# EAGLE design PFC_drivers_v1 (EAGLE 7.6.0)
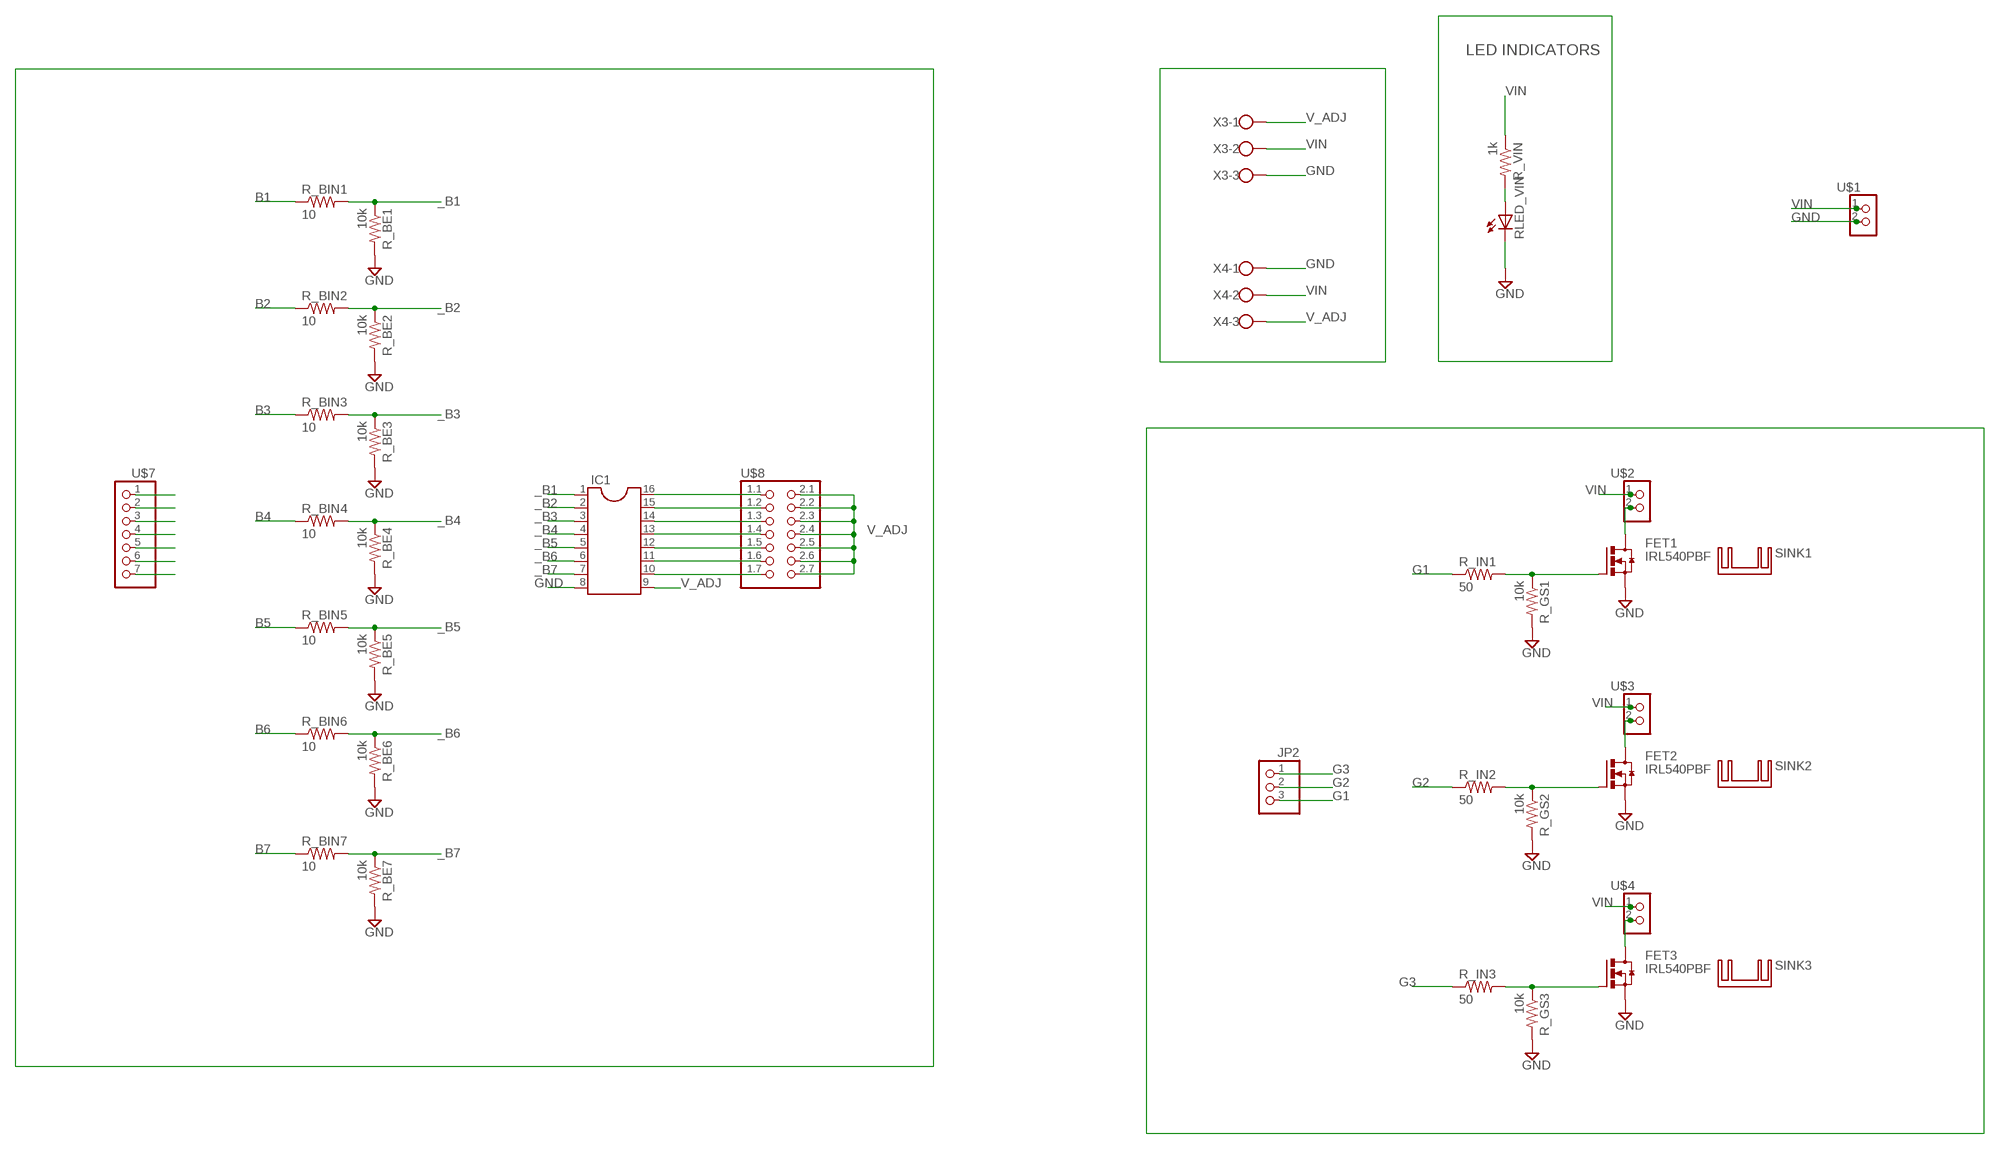
[diagram p0: schematic, sheet 1]

## Parts
FET1  IRL540PBF  [TO220AV]
FET2  IRL540PBF  [TO220AV]
FET3  IRL540PBF  [TO220AV]
IC1  DIL16S  [SOCKET-16]
JP2  PINHD-1X3  [1X03]
R_BE1  10k  R-US_R0603  [R0603]
R_BE2  10k  R-US_R0603  [R0603]
R_BE3  10k  R-US_R0603  [R0603]
R_BE4  10k  R-US_R0603  [R0603]
R_BE5  10k  R-US_R0603  [R0603]
R_BE6  10k  R-US_R0603  [R0603]
R_BE7  10k  R-US_R0603  [R0603]
R_BIN1  10  R-US_R0603  [R0603]
R_BIN2  10  R-US_R0603  [R0603]
R_BIN3  10  R-US_R0603  [R0603]
R_BIN4  10  R-US_R0603  [R0603]
R_BIN5  10  R-US_R0603  [R0603]
R_BIN6  10  R-US_R0603  [R0603]
R_BIN7  10  R-US_R0603  [R0603]
R_GS1  10k  R-US_R0603  [R0603]
R_GS2  10k  R-US_R0603  [R0603]
R_GS3  10k  R-US_R0603  [R0603]
R_IN1  50  R-US_R0603  [R0603]
R_IN2  50  R-US_R0603  [R0603]
R_IN3  50  R-US_R0603  [R0603]
R_VIN  1k  R-US_R0603  [R0603]
RLED_VIN  LEDCHIP-LED0603  [CHIP-LED0603]
SINK1  FW1S  [FW1S]
SINK2  FW1S  [FW1S]
SINK3  FW1S  [FW1S]
U$1  PINHD-2X1  [2X01]
U$2  PINHD-2X1  [2X01]
U$3  PINHD-2X1  [2X01]
U$4  PINHD-2X1  [2X01]
U$7  PINHD-1X7  [1X07]
U$8  PINHD-2X7  [2X07-BIG]
X3  W237-103  [W237-103]
X4  W237-103  [W237-103]

## Nets
_B1: IC1.1 R_BE1.1 R_BIN1.2
_B2: IC1.2 R_BE2.1 R_BIN2.2
_B3: IC1.3 R_BE3.1 R_BIN3.2
_B4: IC1.4 R_BE4.1 R_BIN4.2
_B5: IC1.5 R_BE5.1 R_BIN5.2
_B6: IC1.6 R_BE6.1 R_BIN6.2
_B7: IC1.7 R_BE7.1 R_BIN7.2
_G1: FET1.B(G) R_GS1.1 R_IN1.2
_G2: FET2.B(G) R_GS2.1 R_IN2.2
_G3: FET3.B(G) R_GS3.1 R_IN3.2
B1: R_BIN1.1 U$7.1
B2: R_BIN2.1 U$7.2
B3: R_BIN3.1 U$7.3
B4: R_BIN4.1 U$7.4
B5: R_BIN5.1 U$7.5
B6: R_BIN6.1 U$7.6
B7: R_BIN7.1 U$7.7
G1: JP2.3 R_IN1.1
G2: JP2.2 R_IN2.1
G3: JP2.1 R_IN3.1
GND: FET1.E(S) FET2.E(S) FET3.E(S) IC1.8 R_BE1.2 R_BE2.2 R_BE3.2 R_BE4.2 R_BE5.2 R_BE6.2 R_BE7.2 R_GS1.2 R_GS2.2 R_GS3.2 RLED_VIN.C U$1.2 X3.3 X4.1
N$1: R_VIN.2 RLED_VIN.A
N$4: IC1.10 U$8.1.7
N$5: IC1.11 U$8.1.6
N$7: IC1.12 U$8.1.5
N$8: IC1.13 U$8.1.4
N$9: IC1.14 U$8.1.3
N$10: IC1.15 U$8.1.2
N$11: IC1.16 U$8.1.1
N$15: FET1.C(D) U$2.2
N$16: FET2.C(D) U$3.2
N$17: FET3.C(D) U$4.2
V_ADJ: IC1.9 U$8.2.1 U$8.2.2 U$8.2.3 U$8.2.4 U$8.2.5 U$8.2.6 U$8.2.7 X3.1 X4.3
VIN: R_VIN.1 U$1.1 U$2.1 U$3.1 U$4.1 X3.2 X4.2

## Notes on the sheet
- LED INDICATORS

## Library data of the parts
FET1-FET3 = transistor-power:IRL540PBF
IC1 = ic-package:DIL16: Dual In Line / Socket
JP2 = adafruit:PINHD-1X3: PIN HEADER
R_BE1-R_BE7 R_BIN1-R_BIN7 R_GS1-R_GS3 R_IN1-R_IN3 R_VIN = resistor:R-US_: RESISTOR, American symbol
RLED_VIN = led:LED: LED OSRAM: - CHIPLED LG R971, LG N971, LY N971, LG Q971, LY Q971, LO R971, LY R971 LH N974, LH R974 LS Q976, LO Q976, LY Q976 LO Q996 - Hyper CHIPLED LW Q18S LB Q993, LB Q99A, LB R99A - SideLED LS A670, LO A670, LY A670, LG A670, LP A670 LB A673, LV A673, LT A673, LW A673 LH A674 LY A675 LS A676, LA A676, LO A676, LY A676, LW A676 LS A679, LY A679, LG A679 - Hyper Micro SIDELED® LS Y876, LA Y876, LO Y876, LY Y876 LT Y87S - SmartLED LW L88C, LW L88S LB L89C, LB L89S, LG L890 LS L89K, LO L89K, LY L89K LS L896, LA L896, LO L896, LY L896 - TOPLED LS T670, LO T670, LY T670, LG T670, LP T670 LSG T670, LSP T670, LSY T670, LOP T670, LYG T670 LG T671, LOG T671, LSG T671 LB T673, LV T673, LT T673, LW T673 LH T674 LS T676, LA T676, LO T676, LY T676, LB T676, LH T676, LSB T676, LW T676 LB T67C, LV T67C, LT T67C, LS T67K, LO T67K, LY T67K, LW E67C LS E67B, LA E67B, LO E67B, LY E67B, LB E67C, LV E67C, LT E67C LW T67C LS T679, LY T679, LG T679 LS T770, LO T770, LY T770, LG T770, LP T770 LB T773, LV T773, LT T773, LW T773 LH T774 LS E675, LA E675, LY E675, LS T675 LS T776, LA T776, LO T776, LY T776, LB T776 LHGB T686 LT T68C, LB T68C - Hyper Mini TOPLED® LB M676 - Mini TOPLED Santana® LG M470 LS M47K, LO M47K, LY M47K Source: http://www.osram.convergy.de LUXEON: - LUMILED® LXK2-PW12-R00, LXK2-PW12-S00, LXK2-PW14-U00, LXK2-PW14-V00 LXK2-PM12-R00, LXK2-PM12-S00, LXK2-PM14-U00 LXK2-PE12-Q00, LXK2-PE12-R00, LXK2-PE12-S00, LXK2-PE14-T00, LXK2-PE14-U00 LXK2-PB12-K00, LXK2-PB12-L00, LXK2-PB12-M00, LXK2-PB14-N00, LXK2-PB14-P00, LXK2-PB14-Q00 LXK2-PR12-L00, LXK2-PR12-M00, LXK2-PR14-Q00, LXK2-PR14-R00 LXK2-PD12-Q00, LXK2-PD12-R00, LXK2-PD12-S00 LXK2-PH12-R00, LXK2-PH12-S00 LXK2-PL12-P00, LXK2-PL12-Q00, LXK2-PL12-R00 Source: www.luxeon.com KINGBRIGHT: KA-3528ASYC Source: www.kingbright.com
SINK1-SINK3 = heatsink:FW1S
U$1-U$4 = pinhead:PINHD-2X1
U$7 = adafruit:PINHD-1X7
U$8 = adafruit:PINHD-2X7
X3 X4 = con-wago-500:W237-103: WAGO SCREW CLAMP; MPN: 237-103; OC_FARNELL: unknown; OC_NEWARK: 18M7116

## Board
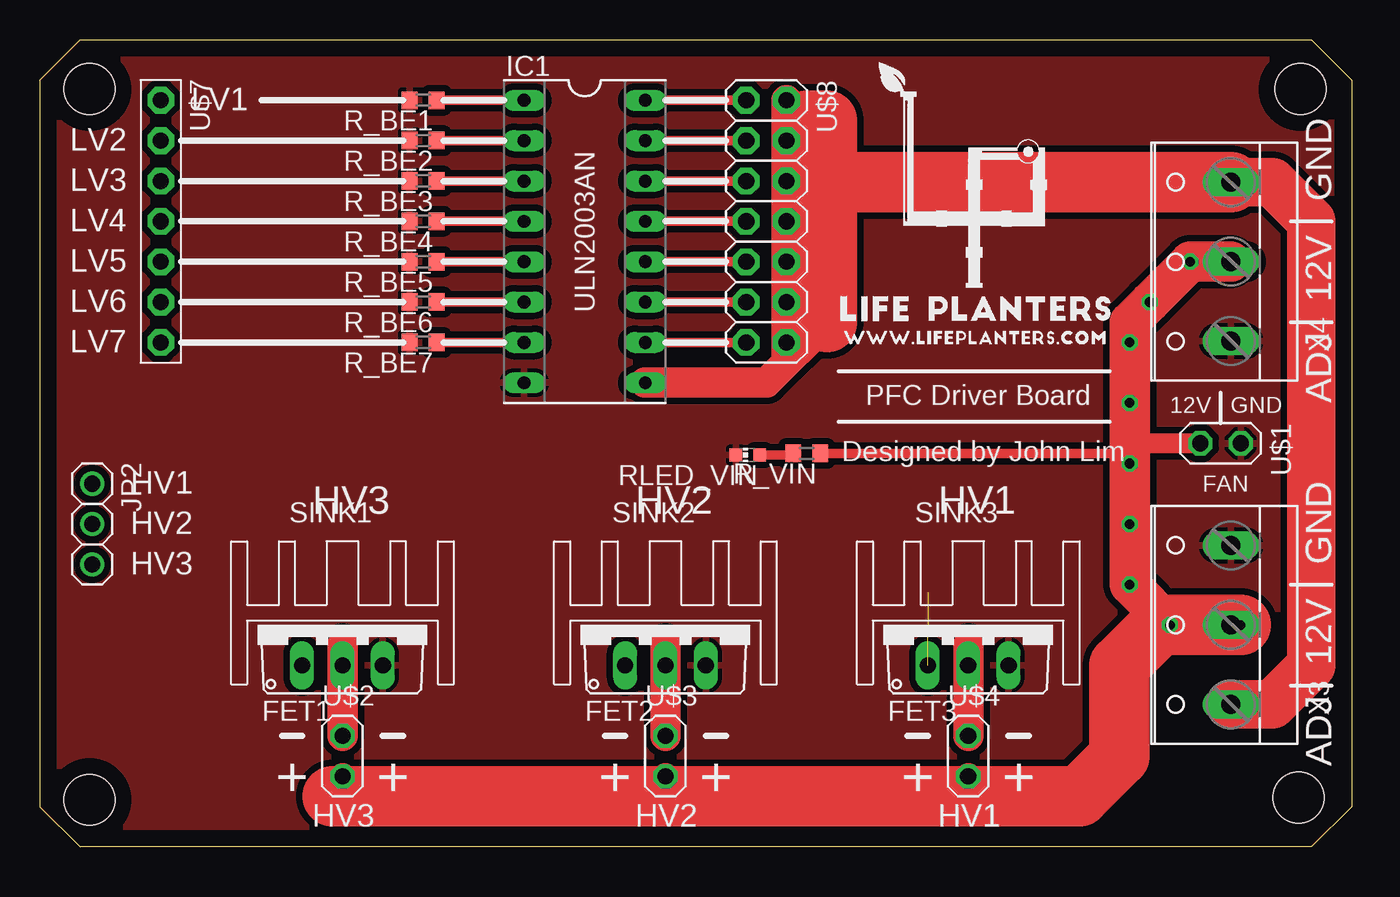
[diagram p1: board, top side]
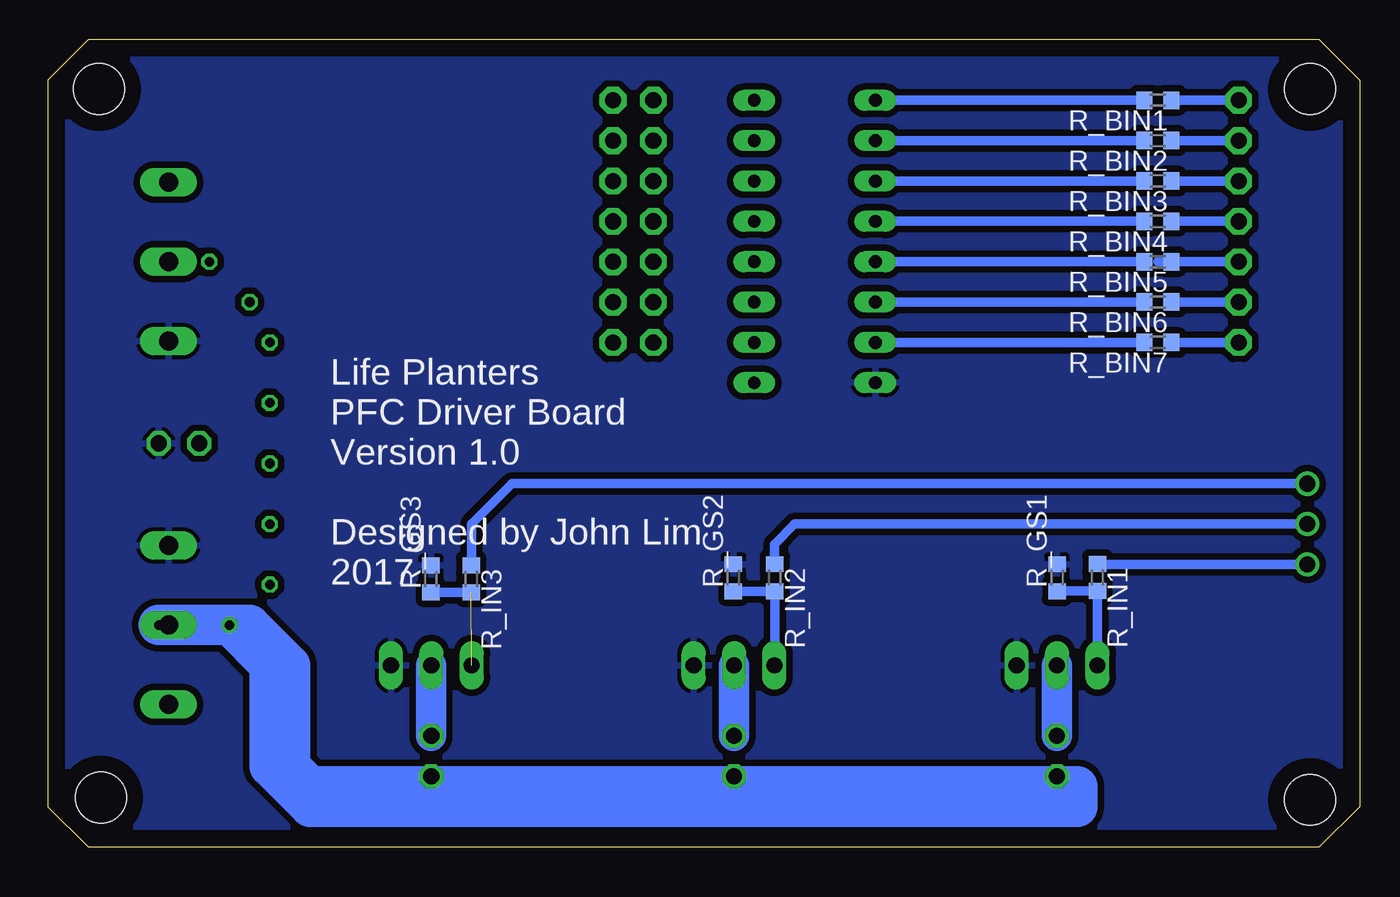
[diagram p2: board, bottom side, seen from below]

Size 82.55 x 50.8 mm. Coordinates in mm from the lower left corner, seen from the top.
Outline: 0,48.26 0,2.54 2.54,0 80.01,0 82.55,2.54 82.55,48.26 80.01,50.8 2.54,50.8 0,48.26
Copper layers (1*16): Top 0.035mm / dielectric 1.5mm / Bottom 0.035mm
Design rules "default": minimum track width 10mil, minimum drill 24mil, track to track 8mil, track to pad 8mil, pad to pad 8mil, via to via 8mil, smd to smd 8mil, copper to edge 40mil, drill to drill 8mil, minimum pad ring 10mil, minimum via ring 8mil, stop-mask expansion 4mil, vias tented up to drill 0mil, thermal gap 10mil
Holes 3.2 mm at 3.12,2.96 3.12,47.69 79.2,3.1 79.33,47.69

### Footprints (pad centres in the part's own frame; a part is rotated, then mirrored left to right if it is on the bottom)
TO220AV = drill 1.016 long: B -2.54,-2.54; C 0,-2.54; E 2.54,-2.54
SOCKET-16 = drill 0.813 long: 1 -8.89,-3.81; 2 -6.35,-3.81; 3 -3.81,-3.81; 4 -1.27,-3.81; 5 1.27,-3.81; 6 3.81,-3.81; 7 6.35,-3.81; 8 8.89,-3.81; 9 8.89,3.81; 10 6.35,3.81; 11 3.81,3.81; 12 1.27,3.81; 13 -1.27,3.81; 14 -3.81,3.81; 15 -6.35,3.81; 16 -8.89,3.81
1X03 = drill 1.016: 1 -2.54,0; 2 0,0; 3 2.54,0
R0603 = smd 1 x 1.1: 1 -0.85,0; 2 0.85,0
CHIP-LED0603 = smd 0.8 x 0.8: A 0,-0.75; C 0,0.75
2X01 = drill 1.016 octagon: 1 -1.27,-1.27; 2 -1.27,1.27
1X07 = drill 1.016 pad 1.676 octagon: 1 -7.62,0; 2 -5.08,0; 3 -2.54,0; 4 0,0; 5 2.54,0; 6 5.08,0; 7 7.62,0
2X07-BIG = drill 1.016 pad 1.676 octagon: 1.1 -7.62,-1.27; 1.2 -5.08,-1.27; 1.3 -2.54,-1.27; 1.4 0,-1.27; 1.5 2.54,-1.27; 1.6 5.08,-1.27; 1.7 7.62,-1.27; 2.1 -7.62,1.27; 2.2 -5.08,1.27; 2.3 -2.54,1.27; 2.4 0,1.27; 2.5 2.54,1.27; 2.6 5.08,1.27; 2.7 7.62,1.27
W237-103 = drill 1.194 long: 1 -5,-1.29; 2 0,-1.29; 3 5,-1.29

### Placement (x,y rotation side)
FET1  19.05,13.97 0 top
FET2  39.37,13.97 0 top
FET3  58.42,13.97 0 top
IC1  34.29,38.1 270 top
JP2  3.3,20.32 270 top
R_BE1  24.13,46.99 180 top
R_BE2  24.13,44.45 180 top
R_BE3  24.13,41.91 180 top
R_BE4  24.13,39.37 180 top
R_BE5  24.13,36.83 180 top
R_BE6  24.13,34.29 180 top
R_BE7  24.13,31.75 180 top
R_BIN1  12.7,46.99 180 bottom
R_BIN2  12.7,44.45 180 bottom
R_BIN3  12.7,41.91 180 bottom
R_BIN4  12.7,39.37 180 bottom
R_BIN5  12.7,36.83 180 bottom
R_BIN6  12.7,34.29 180 bottom
R_BIN7  12.7,31.75 180 bottom
R_GS1  19.05,16.94 90 bottom
R_GS2  39.42,16.94 90 bottom
R_GS3  58.45,16.87 90 bottom
R_IN1  16.51,16.97 270 bottom
R_IN2  36.8,16.94 270 bottom
R_IN3  55.91,16.87 270 bottom
R_VIN  48.26,24.77 180 top
RLED_VIN  44.55,24.66 90 top
SINK1  19.05,15.24 0 top
SINK2  39.37,15.24 0 top
SINK3  58.42,15.24 0 top
U$1  74.3,24.13 270 top
U$2  20.32,5.71 0 top
U$3  40.64,5.71 0 top
U$4  59.69,5.71 0 top
U$7  7.62,39.37 270 top
U$8  45.72,39.37 270 top
X3  73.66,13.97 90 top
X4  73.66,36.83 90 top

### Tracks (layer width: path | path; a pad name or v marks a point on that pad's centre or on a via)
_B1
  Top 0.61: IC1.1 R_BE1.1
  Bottom 0.61: R_BIN1.2 IC1.1
_B2
  Top 0.61: R_BE2.1 IC1.2
  Bottom 0.61: IC1.2 R_BIN2.2
_B3
  Top 0.61: R_BE3.1 IC1.3
  Bottom 0.61: R_BIN3.2 IC1.3
_B4
  Top 0.61: R_BE4.1 IC1.4
  Bottom 0.61: IC1.4 R_BIN4.2
_B5
  Top 0.61: R_BE5.1 IC1.5
  Bottom 0.61: R_BIN5.2 IC1.5
_B6
  Top 0.61: R_BE6.1 IC1.6
  Bottom 0.61: IC1.6 R_BIN6.2
_B7
  Top 0.61: R_BE7.1 IC1.7
  Bottom 0.61: R_BIN7.2 IC1.7
_G1
  Bottom 0.61: FET1.B R_IN1.2 19.02,16.12 R_GS1.1
_G2
  Bottom 0.61: FET2.B 36.8,11.45 R_IN2.2 R_GS2.1
_G3  (1 unrouted)
  Bottom 0.61: R_IN3.2 R_GS3.1
B1
  Bottom 0.61: U$7.1 R_BIN1.1
B2
  Bottom 0.61: R_BIN2.1 U$7.2
B3
  Bottom 0.61: U$7.3 R_BIN3.1
B4
  Bottom 0.61: R_BIN4.1 U$7.4
B5
  Bottom 0.61: 12.7,36.83 R_BIN5.1 U$7.5
B6
  Bottom 0.61: R_BIN6.1 U$7.6
B7
  Bottom 0.61: U$7.7 R_BIN7.1
G1
  Bottom 0.61: R_IN1.1 16.47,17.78 JP2.3
G2
  Bottom 0.61: R_IN2.1 36.83,17.82 36.83,19.05 35.56,20.32 JP2.2
G3
  Bottom 0.61: R_IN3.1 55.88,17.74 55.88,20.32 53.34,22.86 JP2.1
GND
  pour Bottom (isolate 0.406): 1.27,2.54 1.27,48.26 2.54,49.53 80.01,49.53 81.28,48.26 81.28,2.54 80.01,1.27 2.54,1.27
  pour Top (isolate 0.406): 1.27,48.26 2.54,49.53 80.01,49.53 81.28,48.26 81.28,2.54 80.01,1.27 2.54,1.27 1.27,2.54
N$1
  Top 0.61: RLED_VIN.A 47.31,24.66 R_VIN.2
N$4
  Top 0.61: IC1.10 U$8.1.7
N$5
  Top 0.61: IC1.11 U$8.1.6
N$7
  Top 0.61: IC1.12 U$8.1.5
N$8
  Top 0.61: IC1.13 U$8.1.4
N$9
  Top 0.61: IC1.14 U$8.1.3
N$10
  Top 0.61: IC1.15 U$8.1.2
N$11
  Top 0.61: IC1.16 U$8.1.1
N$15
  Top 1.93: U$2.2 19.05,12.7
  Bottom 1.93: FET1.C U$2.2
N$16
  Top 1.93: U$3.2 39.37,12.7
  Bottom 1.93: FET2.C U$3.2
N$17
  Top 1.93: U$4.2 58.42,12.7
  Bottom 1.93: FET3.C U$4.2
V_ADJ
  Top 1.93: IC1.9 45.72,29.21 46.99,30.48 | 46.99,30.48 U$8.2.7 | U$8.2.3 U$8.2.4 U$8.2.5 U$8.2.6 U$8.2.7 | U$8.2.3 U$8.2.2 | U$8.2.2 U$8.2.1 48.26,45.72 | U$8.2.2 48.26,44.45 | U$8.2.3 48.26,41.91 | 46.99,30.48 48.26,31.75 U$8.2.7
  Top 3.048: X3.1 77.55,8.97 80.01,11.43 80.01,39.37 77.55,41.83 X4.3
  Top 3.81: X4.3 48.26,41.83 48.26,41.91 48.26,44.45 48.26,45.72 49.53,45.72 49.53,33.02
VIN  (via drill 0.6)  (1 unrouted)
  Top 0.61: 67.73,20.74 68.58,21.59 | 68.58,30.06 68.58,29.21 | 69,26.25 68.58,26.67 | 68.58,25.4 67.95,24.77 R_VIN.1
  Top 1.27: U$1.1 68.58,25.4
  Top 1.676: U$2.1 19.05,2.54 18.41,3.17 | U$3.1 39.37,3.81 58.42,3.81 | U$4.1 58.42,3.81 | 65.41,3.17 59.05,3.17 58.42,3.81
  Top 2.54: X4.2 v72.39,36.83 v69.85,34.29 68.58,33.02 v68.58,31.75 68.58,29.21 v68.58,27.94 68.58,26.67 68.58,25.4 v68.58,24.13 68.58,21.59 v68.58,20.32 v68.58,16.51 v71.12,13.97 74.93,13.97
  Top 3.81: v75.57,13.97 70.48,13.97 67.95,11.43 67.95,5.71 65.41,3.17 18.41,3.17
  Bottom 2.54: v71.12,13.97 68.58,11.43 68.58,5.08 66.04,2.54 17.78,2.54 17.78,3.81 66.04,3.81 67.31,5.08 67.31,11.43 69.85,13.97 v75.57,13.97

### Text on the board
tPlace: LV1 | LV2 | LV3 | GND | LV4 | LV5 | 12V | LV6 | ULN2003AN | LV7 | /Users/johnlimjsj/Google Drive/ExternalProjects/LifePlanters/Food Computer/Hardware/Graphics/Logo-Eagle.bmp | PFC Driver Board | ADJ | 12V | GND | Designed by John Lim | HV1 | FAN | HV3 | HV2 | HV1 | HV2 | HV3 | GND | 12V | ADJ | + | + | + | + | + | + | HV3 | HV2 | HV1
bPlace: Life Planters / PFC Driver Board / Version 1.0 / / Designed by John Lim / 2017